# Altium project PCI Express x4 - 111.15x167.65mm.PrjPCB
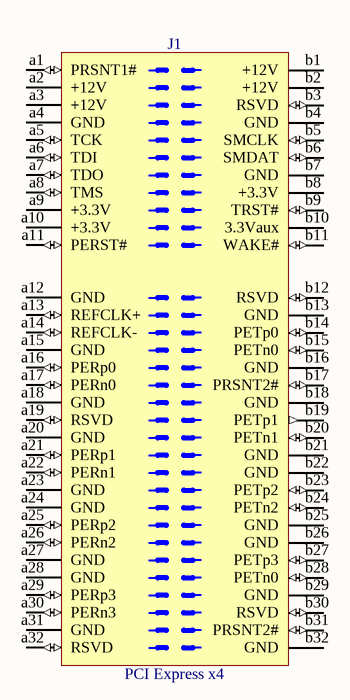
[diagram p0: Connector.SchDoc]
1 sheet, 1 parts. Net scope: global (net labels, ports and power ports of the same name join across sheets).
Board file: PCI Express x4 - 111.15x167.65mm.pcbdoc

## Sheet Connector.SchDoc
size 420 x 297 mm

### Parts
J1  PCI Express x4  [PCI Express x4]

### Nets

Not connected (* = marked no-connect by the designer): J1 a1(PRSNT1#) a2(+12V) a3(+12V) a4(GND) a5(TCK) a6(TDI) a7(TDO) a8(TMS) a9(+3.3V) a10(+3.3V) a11(PERST#) a12(GND) a13(REFCLK+) a14(REFCLK-) a15(GND) a16(PERp0) a17(PERn0) a18(GND) a19(RSVD) a20(GND) a21(PERp1) a22(PERn1) a23(GND) a24(GND) a25(PERp2) a26(PERn2) a27(GND) a28(GND) a29(PERp3) a30(PERn3) a31(GND) a32(RSVD) b1(+12V) b2(+12V) b3(RSVD) b4(GND) b5(SMCLK) b6(SMDAT) b7(GND) b8(+3.3V) b9(TRST#) b10(3.3Vaux) b11(WAKE#) b12(RSVD) b13(GND) b14(PETp0) b15(PETn0) b16(GND) b17(PRSNT2#) b18(GND) b19(PETp1) b20(PETn1) b21(GND) b22(GND) b23(PETp2) b24(PETn2) b25(GND) b26(GND) b27(PETp3) b28(PETn0) b29(GND) b30(RSVD) b31(PRSNT2#) b32(GND)

### Notes on the sheet
- Project/Equipment
- Document
- Designer
- Drawn by
- Check.by
- File
- Last Mod.
- Print Date
- Sheet
- Size
- A3
- of
- Rev

### Library data of the parts
J1 = PCI Express x4: 64 contacts Board Eddge PCI Express x4 Connector; Manufacturer: PCI-SIG; Mounted: No; Table: Miscellaneous; Part Number: PCI Express x4; Component Kind: Standard (No BOM); Component Type: Standard (No BOM); Designator: PCI Express x4; Pin Count: 64; Family: PCI Express x4; Socket: No; SMD: No; Status: None; Part Description: 64 contacts Board Eddge PCI Express x4 Connector; ComponentHeight: 0mm; Datasheet: \\cern.ch\dfs\Applications\Altium\Datasheets\PCI Express x4.pdf; HelpURL: \\cern.ch\dfs\Applications\Altium\Datasheets\PCI Express x4.pdf; Author: CERN DEM JLC; CreateDate: 12/3/2009; LatestRevisionDate: 12/3/2009